# EAGLE design pcb (EAGLE 7.3.0)
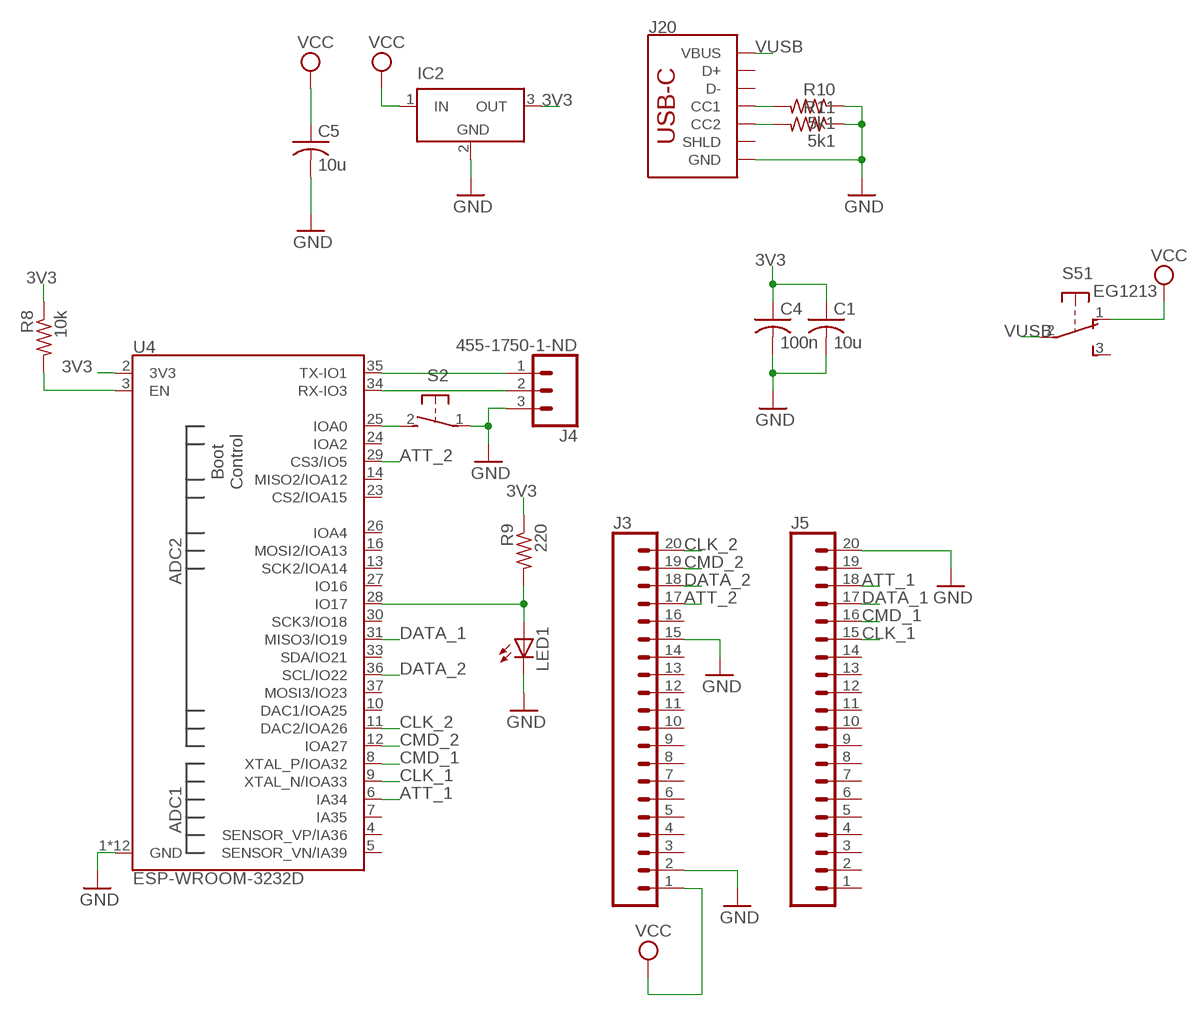
[diagram p0: schematic, sheet 1]

## Parts
C1  10u  C-USC0805  [C0805]
C4  100n  C-USC0805  [C0805]
C5  10u  C-USC0805  [C0805]
IC2  LT1129CST5  [SOT223]
J3  CONN_20  [1X20]
J4  455-1750-1-ND  CONN_03  [1X03]
J5  CONN_20  [1X20]
J20  USB_C_2-LAYER_PADS  [USB-C-16P-2LAYER-PADS]
LED1  LEDCHIP-LED0805  [CHIP-LED0805]
R8  10k  R-US_R0805  [R0805]
R9  220  R-US_R0805  [R0805]
R10  5k1  R-US_R0805  [R0805]
R11  5k1  R-US_R0805  [R0805]
S2  31-XX  [B3F-31XX]
S5  EG1213  [EG1213]
U4  ESP-WROOM-3232D  [ESP-WROOM-32D]

## Nets
3V3: C1.1 C4.1 IC2.3(OUT) R8.1 R9.1 U4.2(3V3)
ATT_1: J5.18 U4.6(IA34)
ATT_2: J3.17 U4.29(CS3/IO5)
CLK_1: J5.15 U4.9(XTAL_N/IOA33)
CLK_2: J3.20 U4.11(DAC2/IOA26)
CMD_1: J5.16 U4.8(XTAL_P/IOA32)
CMD_2: J3.19 U4.12(IOA27)
DATA_1: J5.17 U4.31(MISO3/IO19)
DATA_2: J3.18 U4.36(SCL/IO22)
GND: C1.2 C4.2 C5.2 IC2.2(GND) J3.2 J3.15 J4.3 J5.20 J20.GND J20.GND2(GND) LED1.C R10.1 R11.1 S2.1(P) U4.1(GND) U4.15(GND) U4.38(GND) U4.GND U4.GNDT1(GND) U4.GNDT2(GND) U4.GNDT3(GND) U4.GNDT4(GND) U4.GNDT5(GND) U4.GNDT6(GND) U4.GNDT7(GND) U4.GNDT8(GND)
N$5: R8.2 U4.3(EN)
N$6: LED1.A R9.2 U4.28(IO17)
N$8: J20.A5(CC1) R10.2
N$9: J20.B5(CC2) R11.2
N$14: S2.2(S) U4.25(IOA0)
RX: J4.2 U4.34(RX-IO3)
TX: J4.1 U4.35(TX-IO1)
VCC: C5.1 IC2.1(IN) J3.1 S5.1(1:O)
VUSB: J20.VBUS1(VBUS) J20.VBUS2(VBUS) S5.2(1:P)
Unconnected: J3.3 J3.4 J3.5 J3.6 J3.7 J3.8 J3.9 J3.10 J3.11 J3.12 J3.13 J3.14 J3.16 J5.1 J5.2 J5.3 J5.4 J5.5 J5.6 J5.7 J5.8 J5.9 J5.10 J5.11 J5.12 J5.13 J5.14 J5.19 J20.A6(D+) J20.A7(D-) J20.B6(D+) J20.B7(D-) J20.SHLD1(SHLD) J20.SHLD2(SHLD) J20.SHLD3(SHLD) J20.SHLD4(SHLD) S5.3(1:S) S5.MT1(MT) S5.MT2(MT) U4.4(SENSOR_VP/IA36) U4.5(SENSOR_VN/IA39) U4.7(IA35) U4.10(DAC1/IOA25) U4.13(SCK2/IOA14) U4.14(MISO2/IOA12) U4.16(MOSI2/IOA13) U4.23(CS2/IOA15) U4.24(IOA2) U4.26(IOA4) U4.27(IO16) U4.30(SCK3/IO18) U4.33(SDA/IO21) U4.37(MOSI3/IO23)

## Power pins joined to a net without a drawn wire
GND: IC2.4(GND)

## Library data of the parts
C1 C4 C5 = rcl:C-US: CAPACITOR, American symbol
IC2 = linear-technology:LT1129CST5: VOLTAGE REGULATOR with shutdown; MPN: LT1129CST-5#PBF; OC_FARNELL: 1663375; OC_NEWARK: 57M2069
J3 J5 = SparkFun-Connectors:CONN_20: Multi connection point. Often used as Generic Header-pin footprint for 0.1 inch spaced/style header connections On any of the 0.1 inch spaced packages, you can populate with these: Break Away Headers - Straight <https://www.sparkfun.com/products/116> (PRT-00116) Break Away Male Headers - Right Angle <https://www.sparkfun.com/products/553> (PRT-00553) Female Headers <https://www.sparkfun.com/products/115> (PRT-00115) Break Away Headers - Machine Pin <https://www.sparkfun.com/products/117> (PRT-00117) Break Away Female Headers - Swiss Machine Pin <https://www.sparkfun.com/products/743> (PRT-00743) For SCREWTERMINALS and SPRING TERMINALS visit here: Screw Terimnals on SparkFun.com <https://www.sparkfun.com/search/results?term=Screw+Terminals> (5mm/3.5mm/2.54mm spacing) This device is also useful as a general connection point to wire up your design to another part of your project. Our various solder wires solder well into these plated through hole pads. Hook-Up Wire - Assortment (Stranded, 22 AWG) <https://www.sparkfun.com/products/11375> (PRT-11375) Hook-Up Wire - Assortment (Solid Core, 22 AWG) <https://www.sparkfun.com/products/11367> (PRT-11367) View the entire wire category on our website here <https://www.sparkfun.com/categories/141> Special notes: Molex polarized connector foot print use with SKU : PRT-08231 with associated crimp pins and housings. 1MM SMD Version SKU: PRT-10208 NOTES ON THE VARIANTS LOCK and LOCK_LONGPADS... This footprint was designed to help hold the alignment of a through-hole component (i.e. 6-pin header) while soldering it into place. You may notice that each hole has been shifted either up or down by 0.005 of an inch from it's more standard position (which is a perfectly straight line). This slight alteration caused the pins (the squares in the middle) to touch the edges of the holes. Because they are alternating, it causes a "brace" to hold the component in place. 0.005 has proven to be the perfect amount of "off-center" position when using our standard breakaway headers. Although looks a little odd when you look at the bare footprint, once you have a header in there, the alteration is very hard to notice. Also,if you push a header all the way into place, it is covered up entirely on the bottom side. Note about LOCK SPECIAL package: This is just like the LOCK variant in that the holes are staggared by 5 mil, but except for the last two holes. They are not altered from the "standard" footprint layout. This is used for a special purpose on the layout of our Graphic LCD Backpack. Make sure you want to use this device before selecting it for you project!
J4 = SparkFun-Connectors:CONN_03: Multi connection point. Often used as Generic Header-pin footprint for 0.1 inch spaced/style header connections On any of the 0.1 inch spaced packages, you can populate with these: Break Away Headers - Straight <https://www.sparkfun.com/products/116> (PRT-00116) Break Away Male Headers - Right Angle <https://www.sparkfun.com/products/553> (PRT-00553) Female Headers <https://www.sparkfun.com/products/115> (PRT-00115) Break Away Headers - Machine Pin <https://www.sparkfun.com/products/117> (PRT-00117) Break Away Female Headers - Swiss Machine Pin <https://www.sparkfun.com/products/743> (PRT-00743) Stackable Header - 3 Pin (Female, 0.1") <https://www.sparkfun.com/products/13875> (PRT-13875) For SCREWTERMINALS and SPRING TERMINALS visit here: Screw Terimnals on SparkFun.com <https://www.sparkfun.com/search/results?term=Screw+Terminals> (5mm/3.5mm/2.54mm spacing) This device is also useful as a general connection point to wire up your design to another part of your project. Our various solder wires solder well into these plated through hole pads. Hook-Up Wire - Assortment (Stranded, 22 AWG) <https://www.sparkfun.com/products/11375> (PRT-11375) Hook-Up Wire - Assortment (Solid Core, 22 AWG) <https://www.sparkfun.com/products/11367> (PRT-11367) View the entire wire category on our website here <https://www.sparkfun.com/categories/141> Special notes: Molex polarized connector foot print use with SKU : PRT-08232 with associated crimp pins and housings.; PROD_ID: XXX-00000
J20 = SparkFun-Connectors:USB_C: USB Type C 16Pin Connector Super Speed pins not available on the 16-pin purely SMD connector so this part is best for USB 2.0 implementations. D1 and D2 are tied together enabling D+/- no matter which way the cable is plugged into the connector. The two channel configuration pins (CC1/2) are exposed. These are normally connected to ground via 5.1k resistors but can be reconfigured for high current/high power applications. **4-LAYER BOARD WARNING!!** If designing 4-layer board, make sure to select the variant _4-LAYER-ISOLATED. The linked footprint (USB-C-16-4LAYER-ISOLATED) includes some very necessary cutout polygons in the inner layers (2 and 15). This prevents the PTH mounting shield legs on the USB connector from electrically connecting any other polygons on the inner layers (usually VCC and GND).; PROD_ID: CONN-14122
LED1 = led:LED: LED OSRAM: - CHIPLED LG R971, LG N971, LY N971, LG Q971, LY Q971, LO R971, LY R971 LH N974, LH R974 LS Q976, LO Q976, LY Q976 LO Q996 - Hyper CHIPLED LW Q18S LB Q993, LB Q99A, LB R99A - SideLED LS A670, LO A670, LY A670, LG A670, LP A670 LB A673, LV A673, LT A673, LW A673 LH A674 LY A675 LS A676, LA A676, LO A676, LY A676, LW A676 LS A679, LY A679, LG A679 - Hyper Micro SIDELED® LS Y876, LA Y876, LO Y876, LY Y876 LT Y87S - SmartLED LW L88C, LW L88S LB L89C, LB L89S, LG L890 LS L89K, LO L89K, LY L89K LS L896, LA L896, LO L896, LY L896 - TOPLED LS T670, LO T670, LY T670, LG T670, LP T670 LSG T670, LSP T670, LSY T670, LOP T670, LYG T670 LG T671, LOG T671, LSG T671 LB T673, LV T673, LT T673, LW T673 LH T674 LS T676, LA T676, LO T676, LY T676, LB T676, LH T676, LSB T676, LW T676 LB T67C, LV T67C, LT T67C, LS T67K, LO T67K, LY T67K, LW E67C LS E67B, LA E67B, LO E67B, LY E67B, LB E67C, LV E67C, LT E67C LW T67C LS T679, LY T679, LG T679 LS T770, LO T770, LY T770, LG T770, LP T770 LB T773, LV T773, LT T773, LW T773 LH T774 LS E675, LA E675, LY E675, LS T675 LS T776, LA T776, LO T776, LY T776, LB T776 LHGB T686 LT T68C, LB T68C - Hyper Mini TOPLED® LB M676 - Mini TOPLED Santana® LG M470 LS M47K, LO M47K, LY M47K Source: http://www.osram.convergy.de LUXEON: - LUMILED® LXK2-PW12-R00, LXK2-PW12-S00, LXK2-PW14-U00, LXK2-PW14-V00 LXK2-PM12-R00, LXK2-PM12-S00, LXK2-PM14-U00 LXK2-PE12-Q00, LXK2-PE12-R00, LXK2-PE12-S00, LXK2-PE14-T00, LXK2-PE14-U00 LXK2-PB12-K00, LXK2-PB12-L00, LXK2-PB12-M00, LXK2-PB14-N00, LXK2-PB14-P00, LXK2-PB14-Q00 LXK2-PR12-L00, LXK2-PR12-M00, LXK2-PR14-Q00, LXK2-PR14-R00 LXK2-PD12-Q00, LXK2-PD12-R00, LXK2-PD12-S00 LXK2-PH12-R00, LXK2-PH12-S00 LXK2-PL12-P00, LXK2-PL12-Q00, LXK2-PL12-R00 Source: www.luxeon.com KINGBRIGHT: KA-3528ASYC Source: www.kingbright.com
R8-R11 = rcl:R-US_: RESISTOR, American symbol
S2 = switch-omron:31-XX: OMRON SWITCH; MPN: B3F-3100; OC_FARNELL: 959704; OC_NEWARK: 36M3582
S5 = adafruit:EG1213: E-Switch right-angle slide SPDT Part #EG1213 http://www.ladyada.net/library/eagle
U4 = SparkFun-RF:ESP-WROOM-32: ESP-WROOM-32D - trace antenna (includes keepout) ESP-WROOM-32U - U.FL antenna connector Includes both "standard" footprints and "narrow" version (for use with tighter layouts).; PROD_ID: IC-15676

## Board
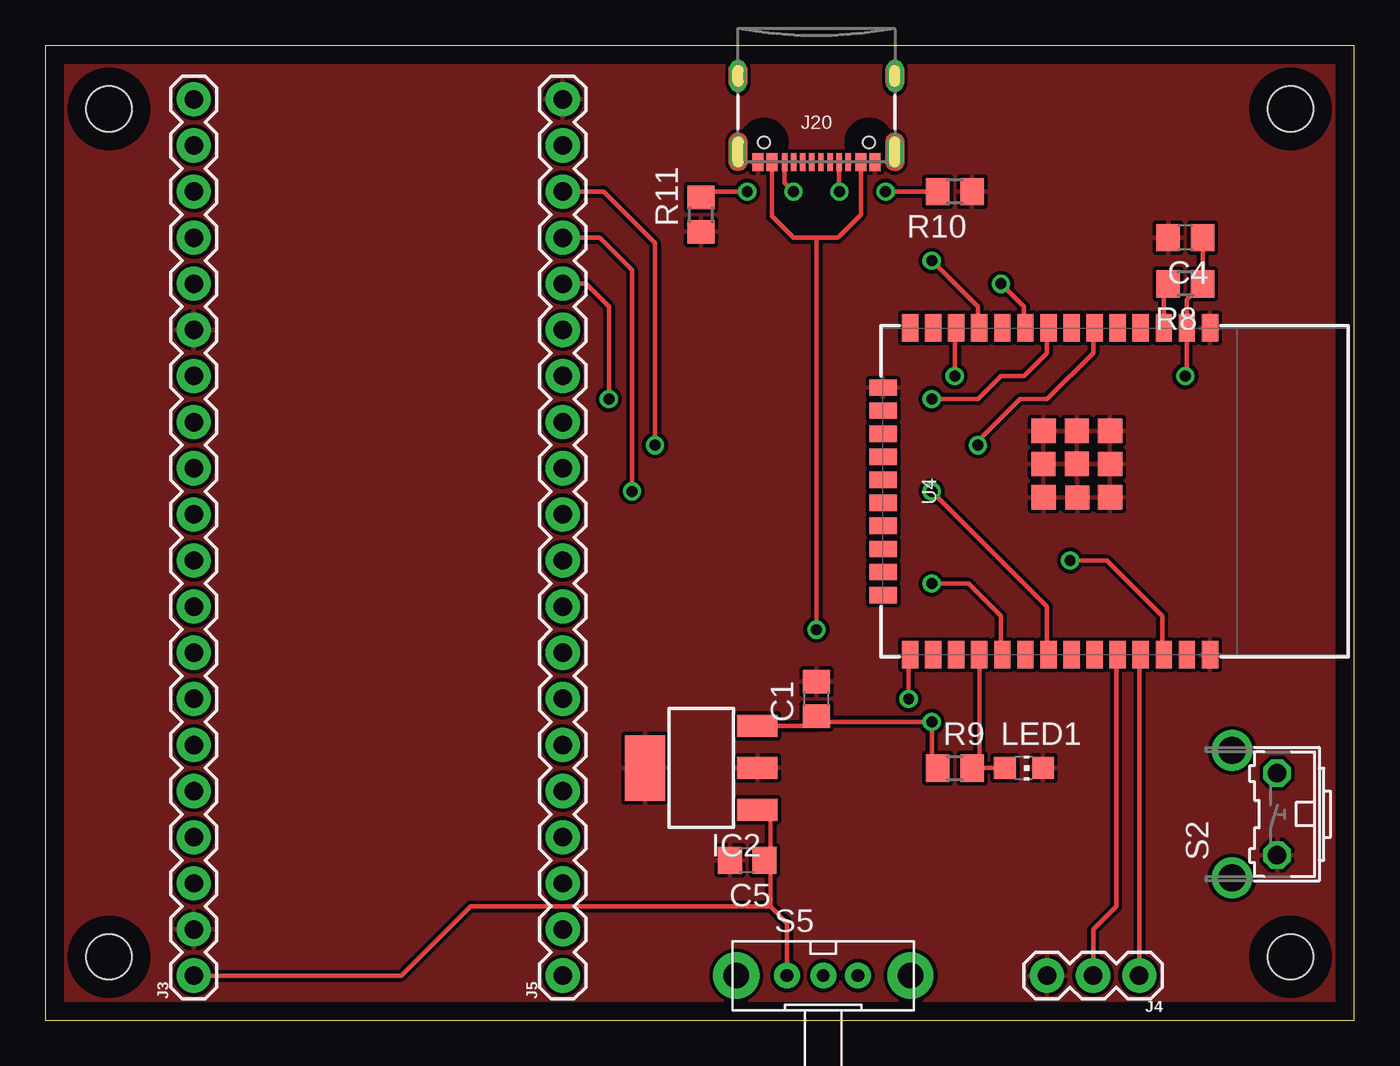
[diagram p1: board, top side]
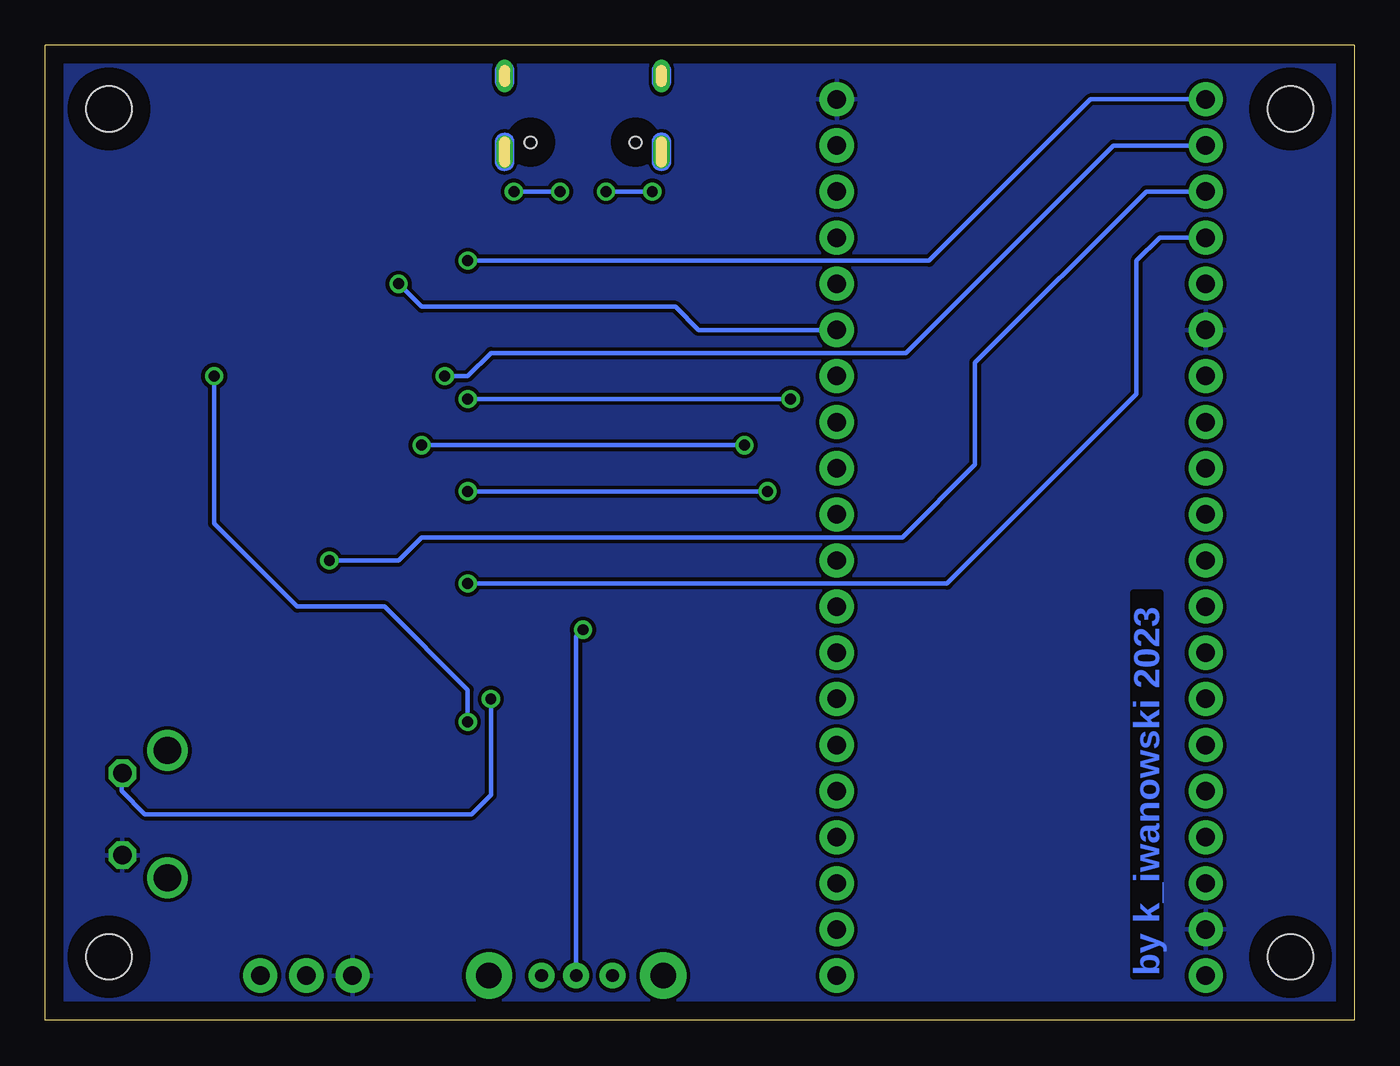
[diagram p2: board, bottom side, seen from below]

Size 72.07 x 53.7 mm. Coordinates in mm from the lower left corner, seen from the top.
Outline: 0,53.7 0,0 72.07,0 72.07,53.7 0,53.7
Copper layers (1*16): Top 0.035mm / dielectric 1.5mm / Bottom 0.035mm
Design rules "default *": minimum track width 8mil, minimum drill 24mil, track to track 8mil, track to pad 8mil, pad to pad 8mil, via to via 8mil, smd to smd 8mil, copper to edge 40mil, drill to drill 8mil, minimum pad ring 10mil, minimum via ring 8mil, stop-mask expansion 4mil, vias tented up to drill 0mil, thermal gap 8mil
Holes 2.5 mm at 3.5,50.2 68.57,50.2 3.5,3.5 68.57,3.5

### Footprints (pad centres in the part's own frame; a part is rotated, then mirrored left to right if it is on the bottom)
C0805 = smd 1.3 x 1.5: 1 -0.95,0; 2 0.95,0
SOT223 = smd 1.219 x 2.235: 1 -2.311,-3.099; 2 0,-3.099; 3 2.311,-3.099 | smd 3.6 x 2.2: 4 0,3.099
1X20 = drill 1.016 pad 1.88: 1 0,0; 2 2.54,0; 3 5.08,0; 4 7.62,0; 5 10.16,0; 6 12.7,0; 7 15.24,0; 8 17.78,0; 9 20.32,0; 10 22.86,0; 11 25.4,0; 12 27.94,0; 13 30.48,0; 14 33.02,0; 15 35.56,0; 16 38.1,0; 17 40.64,0; 18 43.18,0; 19 45.72,0; 20 48.26,0
1X03 = drill 1.016 pad 1.88: 1 0,0; 2 2.54,0; 3 5.08,0
USB-C-16P-2LAYER-PADS = smd 0.3 x 1: A5 -1.25,-0.34; A6 -0.25,-0.34; A7 0.25,-0.34; A8 1.25,-0.34; B5 1.75,-0.34; B6 0.75,-0.34; B7 -0.75,-0.34; B8 -1.75,-0.34 | smd 0.6 x 1: GND -3.225,-0.34; GND2 3.225,-0.34; VBUS1 -2.45,-0.34; VBUS2 2.45,-0.34 | drill 0.4 pad 0.6 long: SHLD1 -4.318,-0.915; SHLD2 4.318,-0.915; SHLD3 -4.318,-5.095; SHLD4 4.318,-5.095 | hole 0.65: -2.89,-1.445; 2.89,-1.445
CHIP-LED0805 = smd 1.2 x 1.2: A 0,-1.05; C 0,1.05
R0805 = smd 1.3 x 1.5: 1 -0.95,0; 2 0.95,0
B3F-31XX = drill 1.016 octagon: 1 -2.261,-1.245; 2 2.261,-1.245 | drill 1.499 pad 2.159: 3 -3.505,1.245; 4 3.505,1.245
EG1213 = drill 0.7 pad 1.422: 1 -2,0; 2 0,0; 3 1.9,0 | drill 1.4 pad 2.54: MT1 -4.8,0; MT2 4.8,0
ESP-WROOM-32D = smd 0.9 x 1.5: 1 7.7,9; 2 6.43,9; 3 5.16,9; 4 3.89,9; 5 2.62,9; 6 1.35,9; 7 0.08,9; 8 -1.19,9; 9 -2.46,9; 10 -3.73,9; 11 -5,9; 12 -6.27,9; 13 -7.54,9; 14 -8.81,9; 25 -8.81,-9; 26 -7.54,-9; 27 -6.27,-9; 28 -5,-9; 29 -3.73,-9; 30 -2.46,-9; 31 -1.19,-9; 32 0.08,-9; 33 1.35,-9; 34 2.62,-9; 35 3.89,-9; 36 5.16,-9; 37 6.43,-9; 38 7.7,-9 | smd 1.5 x 0.9: 15 -10.3,5.715; 16 -10.3,4.445; 17 -10.3,3.175; 18 -10.3,1.905; 19 -10.3,0.635; 20 -10.3,-0.635; 21 -10.3,-1.905; 22 -10.3,-3.175; 23 -10.3,-4.445; 24 -10.3,-5.715 | smd 1.33 x 1.33: GND 0.379,1.515; GNDT1 -1.46,3.33; GNDT2 -1.47,1.5; GNDT3 -1.46,-0.33; GNDT4 0.4,-0.34; GNDT5 2.2,-0.33; GNDT6 2.2,1.5; GNDT7 2.2,3.33; GNDT8 0.37,3.33

### Placement (x,y rotation side)
C1  42.46,17.71 90 top
C4  62.78,43.11 180 top
C5  38.65,8.82 180 top
IC2  36.11,13.9 90 top
J3  8.17,2.47 90 top
J4  60.24,2.47 180 top
J5  28.49,2.47 90 top
J20  42.46,46.92 180 top
LED1  53.89,13.9 270 top
R8  62.78,40.57 180 top
R9  50.08,13.9 0 top
R10  50.08,45.65 180 top
R11  36.11,44.38 90 top
S2  66.59,11.36 90 top
S5  42.84,2.47 0 top
U4  56.43,29.14 0 top

### Tracks (layer width: path | path; a pad name or v marks a point on that pad's centre or on a via)
3V3  (via drill 0.6)
  Top 0.254: v62.78,35.49 62.86,35.49 U4.2 62.86,39.7 R8.1 | R8.1 C4.1 | R8.1 64.05,40.57 | R9.1 48.81,13.9 v48.81,16.44 42.46,16.44 C1.1 42.46,16.21 IC2.3
  Bottom 0.254: v48.81,16.44 48.81,18.21 53.39,22.79 58.2,22.79 62.78,27.37 v62.78,35.49
ATT_1  (via drill 0.6)
  Top 0.254: U4.6 57.7,38.14 57.7,36.76 55.16,34.22 53.67,34.22 51.35,31.9 v51.35,31.68 | J5.18 30.73,45.65 33.57,42.81 v33.57,31.68
  Bottom 0.254: v51.35,31.68 v33.57,31.68
ATT_2  (via drill 0.6)
  Top 0.254: U4.29 52.62,20.14 52.62,22.26 50.82,24.06 v48.81,24.06
  Bottom 0.254: J3.17 10.71,43.11 11.98,41.84 11.98,34.5 22.42,24.06 v48.81,24.06
CLK_1  (via drill 0.6)
  Top 0.254: U4.9 53.89,38.14 53.89,39.3 v52.62,40.57
  Bottom 0.254: v52.62,40.57 51.35,39.3 37.38,39.3 36.11,38.03 J5.15
CLK_2  (via drill 0.6)
  Top 0.254: U4.11 51.35,38.14 51.35,39.3 v48.81,41.84
  Bottom 0.254: v48.81,41.84 23.41,41.84 14.52,50.73 J3.20
CMD_1  (via drill 0.6)
  Top 0.254: U4.8 55.16,38.14 55.16,36.76 53.89,35.49 52.62,35.49 51.35,34.22 v48.81,34.22 | J5.16 29.76,40.57 31.03,39.3 v31.03,34.22
  Bottom 0.254: v31.03,34.22 v48.81,34.22
CMD_2  (via drill 0.6)
  Top 0.254: U4.12 50.08,38.14 v50.08,35.49
  Bottom 0.254: v50.08,35.49 48.81,35.49 47.54,36.76 24.68,36.76 13.25,48.19 J3.19
DATA_1  (via drill 0.6)
  Top 0.254: U4.31 55.16,20.14 55.16,22.79 v48.81,29.14 | J5.17 30.5,43.11 32.3,41.31 v32.3,29.14
  Bottom 0.254: v48.81,29.14 v32.3,29.14
DATA_2  (via drill 0.6)
  Top 0.254: U4.36 61.51,20.14 61.51,22.26 58.44,25.33 v56.43,25.33
  Bottom 0.254: v56.43,25.33 52.62,25.33 51.35,26.6 24.89,26.6 20.87,30.62 20.87,36.23 11.45,45.65 J3.18
GND
  pour Bottom: -0.72,54.54 72.94,54.54 72.94,-1.34 -0.72,-1.34
  pour Top: 72.94,54.54 72.94,-1.34 -0.72,-1.34 -0.72,54.54
N$5
  Top 0.254: R8.2 61.59,40.57 U4.3
N$6
  Top 0.254: 51.43,13.9 U4.28 | LED1.A 51.43,13.9 | 51.43,13.9 R9.2
N$8  (via drill 0.6)
  Top 0.254: v43.73,45.65 43.71,45.65 J20.A5 | v46.27,45.65 R10.2
  Bottom 0.254: v46.27,45.65 v43.73,45.65
N$9  (via drill 0.6)
  Top 0.254: v41.19,45.65 40.71,46.13 J20.B5 | v38.65,45.65 36.11,45.65 R11.2
  Bottom 0.254: v38.65,45.65 v41.19,45.65
N$14  (via drill 0.6)
  Top 0.254: U4.25 47.54,20.14 v47.54,17.71
  Bottom 0.254: S2.2 67.86,13.62 67.86,12.63 66.59,11.36 48.59,11.36 47.54,12.41 v47.54,17.71
RX
  Top 0.254: U4.34 58.97,20.14 58.97,6.28 57.7,5.01 J4.2
TX
  Top 0.254: U4.35 60.24,20.14 J4.1
VCC
  Top 0.254: 39.92,6.28 23.41,6.28 22.14,5.01 19.6,2.47 J3.1 | 39.92,6.28 40.84,5.36 S5.1 | C5.1 39.92,8.82 | 39.92,8.82 39.92,6.28 | IC2.1 39.92,11.59 39.92,8.82
VUSB  (via drill 0.6)
  Top 0.254: J20.VBUS1 44.91,44.38 43.64,43.11 42.46,43.11 | J20.VBUS2 40.01,44.29 41.19,43.11 42.46,43.11 | 42.46,43.11 v42.46,21.52
  Bottom 0.254: v42.46,21.52 42.84,21.14 S5.2

### Text on the board
Bottom: by k_iwanowski 2023